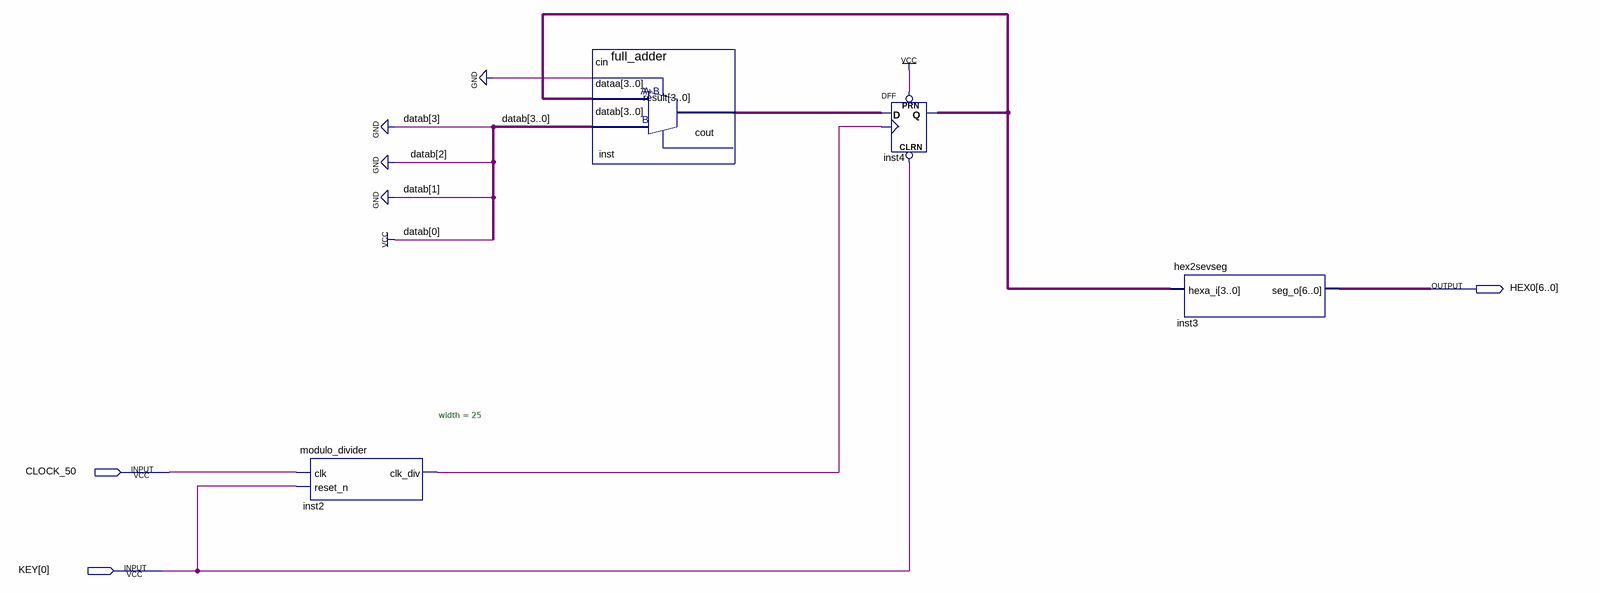
[diagram p0: schematic sheet]
// Quartus schematic lab1_start.bdf as structural Verilog: 4 symbols, 3 pins
module lab1_start (
  input  CLOCK_50,
  input  [0:0] KEY,
  output [6:0] HEX0
);

  wire inst2_clk_div;
  wire [3:0] inst4_q, inst_result;

  modulo_divider #(.width(25)) inst2 (.clk(CLOCK_50), .reset_n(KEY[0]), .clk_div(inst2_clk_div));
  full_adder inst (.cin(1'b0), .dataa(inst4_q), .datab(4'b0001), .result(inst_result));  // open: cout
  DFF inst4[3:0] (.CLRN(KEY[0]), .CLK(inst2_clk_div), .D(inst_result), .PRN(1'b1), .Q(inst4_q));
  hex2sevseg inst3 (.hexa_i(inst4_q), .seg_o(HEX0));
endmodule
